# Altium schematic sheet IMU_Radio.SchDoc: Wacky Hat Schematic
size A3; DrawnBy: A. Finlayson, H. Pollard; Organization: Group 17; Address1: ECE Department; Address2: University of Canterbury; Address3: Christchurch 8041; Address4: New Zealand; Revision: 1; SheetNumber: 1; SheetTotal: 3
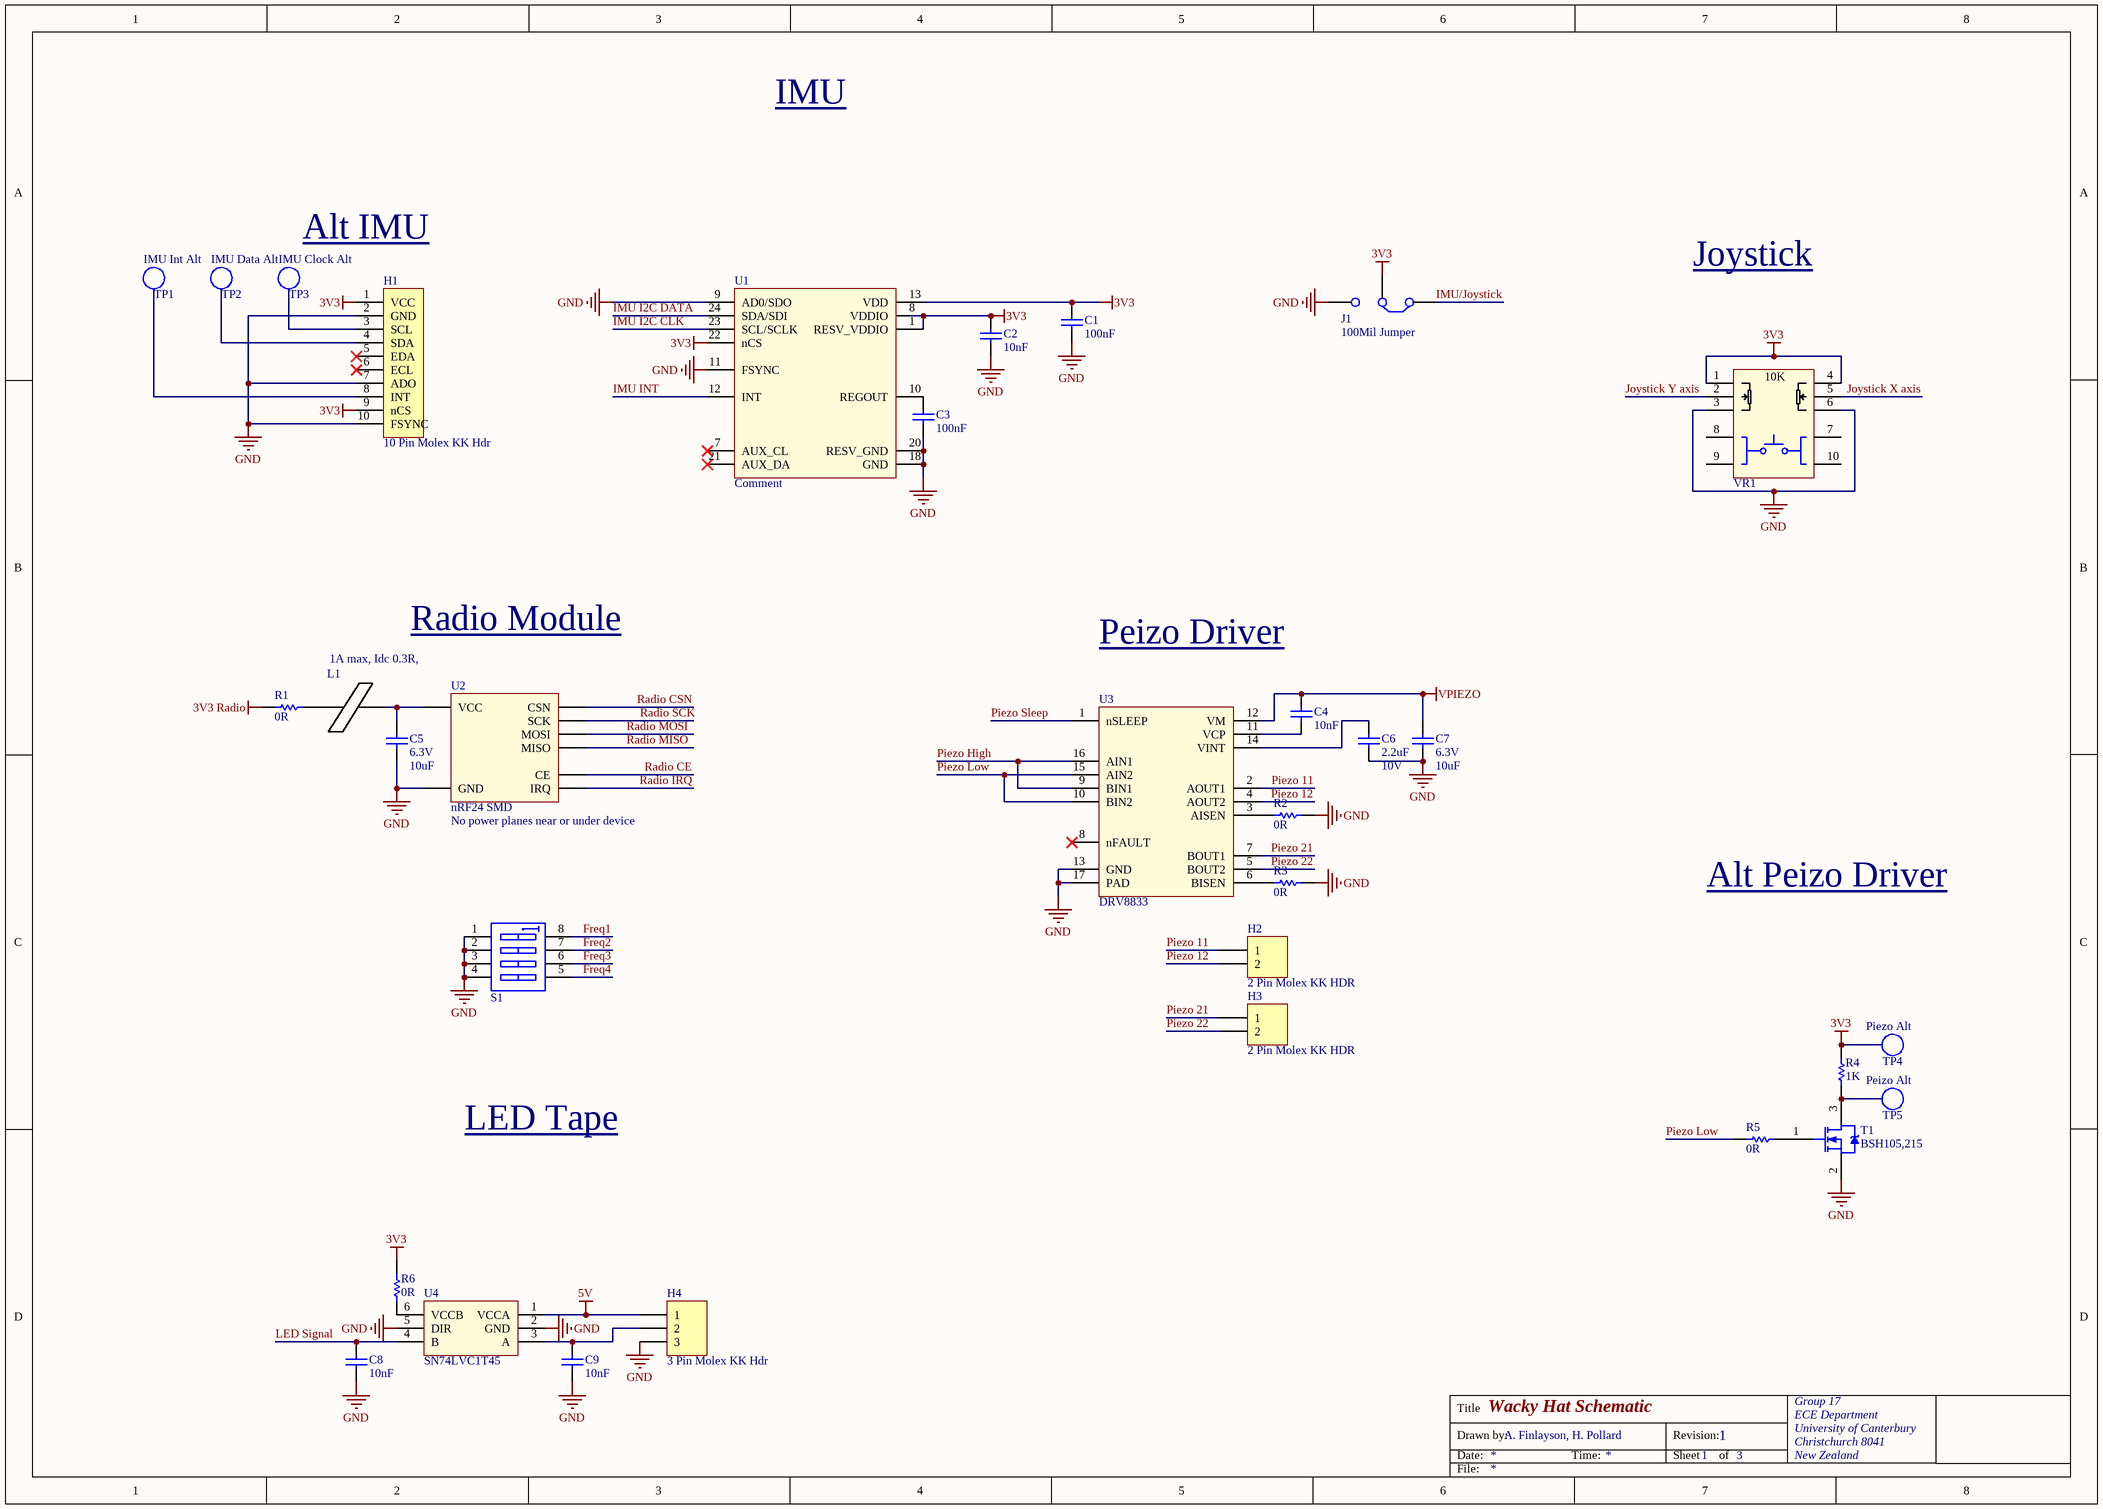
[diagram p0: IMU_Radio.SchDoc]

## Parts
C1  100nF  [CAPC1608L]
C2  10nF  [CAPC1608L]
C3  100nF  [CAPC1608L]
C4  10nF  [CAPC1608L]
C5  Voltage - Rated: 6.3V  [CAPC1608L]  (hidden comment: 10uF)
C6  Max Voltage: 10V  [CAPC1608L]  (hidden comment: 2.2uF)
C7  Voltage - Rated: 6.3V  [CAPC1608L]  (hidden comment: 10uF)
C8  10nF  [CAPC1608L]
C9  10nF  [CAPC1608L]
H1  10 Pin Molex KK Hdr  [MOLEX_KK_10_HDR]
H2  2 Pin Molex KK HDR  [MOLEX_KK_2_HDR]
H3  2 Pin Molex KK HDR  [MOLEX_KK_2_HDR]
H4  3 Pin Molex KK Hdr  [MOLEX_KK_3_HDR]
J1  100Mil Jumper  [JMP2.54-CO]
L1  1A max, Idc 0.3R,  [INDC3216L]
R1  0R  [RESC1608L]
R2  0R  [RESC1608L]
R3  0R  [RESC1608L]
R4  1K  [RESC1608L]
R5  0R  [RESC1608L]
R6  0R  [RESC1608L]
S1  WS_SW DIP-4  [DIP_SW_4WAY_SMD -]  (value not drawn)
T1  BSH105,215  [SOT23_L]
TP1  IMU Int Alt  [TP_0603]
TP2  IMU Data Alt  [TP_0603]
TP3  IMU Clock Alt  [TP_0603]
TP4  Piezo Alt  [TP_0603]
TP5  Peizo Alt  [TP_0603]
U1  Comment  [Quad24]
U2  nRF24 SMD  Warning: No power planes near or under device  [NRF24]
U3  DRV8833  [HTSOP16]
U4  SN74LVC1T45  [SOT23-6_N]
VR1  Joystick 10k with Sw  [Joystick_Sw]  (value not drawn)

## Nets
3V3: C1.2 C2.2 H1.1(VCC) H1.9(nCS) J1.2(C2) R4.2 R6.2 TP4.1(TP) U1.1(RESV_VDDIO) U1.8(VDDIO) U1.13(VDD) U1.22(nCS) VR1.1 VR1.4(1')
3V3 Radio: R1.1
5V: H4.1 U4.1(VCCA)
GND: C1.1 C2.1 C3.1 C5.1 C6.2 C7.1 C8.1 C9.1 H1.2(GND) H1.7(ADO) H1.10(FSYNC) H4.3 J1.3(C3) R2.2 R3.2 S1.1(A1) S1.2(A2) S1.3(A3) S1.4(A4) T1.2 U1.9(AD0/SDO) U1.11(FSYNC) U1.18(GND) U1.20(RESV_GND) U2.2(GND) U3.13(GND) U3.17(PAD) U4.2(GND) U4.5(DIR) VR1.3 VR1.6(3')
VPIEZO: C4.2 C7.2 U3.12(VM)
Freq1: S1.8(B1)
Freq2: S1.7(B2)
Freq3: S1.6(B3)
Freq4: S1.5(B4)
IMU I2C CLK: U1.23(SCL/SCLK)
IMU I2C DATA: U1.24(SDA/SDI)
IMU INT: U1.12(INT)
IMU/Joystick: J1.1(C1)
Joystick X axis: VR1.5(2')
Joystick Y axis: VR1.2
LED Signal: C8.2 U4.4(B)
Piezo 11: H2.1 U3.2(AOUT1)
Piezo 12: H2.2 U3.4(AOUT2)
Piezo 21: H3.1 U3.7(BOUT1)
Piezo 22: H3.2 U3.5(BOUT2)
Piezo High: U3.9(BIN1) U3.16(AIN1)
Piezo Low: R5.1 U3.10(BIN2) U3.15(AIN2)
Piezo Sleep: U3.1(nSLEEP)
Radio CE: U2.3(CE)
Radio CSN: U2.4(CSN)
Radio IRQ: U2.8(IRQ)
Radio MISO: U2.7(MISO)
Radio MOSI: U2.6(MOSI)
Radio SCK: U2.5(SCK)
NetC3_2: C3.2 U1.10(REGOUT)
NetC4_1: C4.1 U3.11(VCP)
NetC5_2: C5.2 L1.1 U2.1(VCC)
NetC6_1: C6.1 U3.14(VINT)
NetC9_2: C9.2 H4.2 U4.3(A)
NetH1_3: H1.3(SCL) TP3.1(TP)
NetH1_4: H1.4(SDA) TP2.1(TP)
NetH1_8: H1.8(INT) TP1.1(TP)
NetL1_2: L1.2 R1.2
NetR2_1: R2.1 U3.3(AISEN)
NetR3_1: R3.1 U3.6(BISEN)
NetR4_1: R4.1 T1.3 TP5.1(TP)
NetR5_2: R5.2 T1.1
NetR6_1: R6.1 U4.6(VCCB)

Not connected (* = marked no-connect by the designer): H1 5(EDA)* 6(ECL)*; U1 7(AUX_CL)* 21(AUX_DA)*; U3 8(nFAULT)*; VR1 7 8 9 10

## Notes on the sheet
- IMU
- Alt IMU
- Joystick
- Radio Module
- Peizo Driver
- Alt Peizo Driver
- LED Tape
- Title
- Drawn by:
- Date:
- Time:
- Revision:
- Sheet
- of
- File:
- (in symbol Joystick 10k with Sw) 10K

## Library data of the parts
C1 C3 = CC_100nF_0603: CAP CER 100nF X7R +-10% 50V 0603; PackageReference: 0603; Code_IPC: 1608 [0603]; Verify: *; Supplier: ECE Dept; Storage Location: PCB Assembly WS; Value: 100nF
C2 C4 C8 C9 = CC_10nF_0603: CAP CER 10nF X7R +-10% 50V 0603; PackageReference: 0603; Code_IPC: 1608 [0603]; Verify: *; Supplier: ECE Dept; Storage Location: PCB Assembly WS; Value: 10nF
C5 C7 = CC_10uF_0603: CAP CER 10UF X5R +-20% 6V3 0603; Supplier: ECE Dept; Storage Location: PCB Assembly WS; Value: 10uF
C6 = CC_2.2uF_0603: CAP CER 2.2uF X5R +-20% 10V 0603; PackageReference: 0603; Code_IPC: 1608 [0603]; Verify: *; Supplier: ECE Dept; Storage Location: PCB Assembly WS; Value: 2.2uF
H1 = JA_MOLEX_KK_10POS: CONN HEADER 10POS 2.54mm VERT_ Thru Hole; Supplier 1: Farnell; Supplier Part Number 1: 1756828; Supplier: ECE Dept; Storage Location: ECE Dept Store; Value: 10 Pin Molex KK Hdr
H2 H3 = JA_MOLEX_KK_2POS: CONN HEADER 2POS 2.54mm VERT_Thru Hole; Supplier 1: Farnell; Supplier Part Number 1: 1462926; Supplier: ECE Dept; Storage Location: ECE Dept Store; Value: 2 Pin Molex KK HDR
H4 = JA_MOLEX_KK_3POS: CONN HEADER 3POS 2.54mm VERT_Thru Hole; Manufacturer: Molex; Manufacturer PN: 22-23-2031; Supplier Part Number 1: 9731156; Supplier: ECE Dept; Supplier 1: Farnell; Storage Location: ECE Dept Store; Value: 3 Pin Molex KK Hdr
J1 = TP_JUMPER_CO: 2.54mm Jumper change over, Thru Hole; Supplier: ECE Dept; Storage Location: ECE$ Store
L1 = IN_Ferrite-Bead: Ferrite Bead, Rdc 0.3R, Z100MHZ 600R, Imax 1A, SMD 1206; Manufacturer: FAIR-RITE; Manufacturer PN: 2512066017Y1; DC Current Rating: 1; DC Resistance Max: 0.08; Ferrite Case Style: 1206 ^3216 Metric]; Frequency Range: 50MHz to 1; Impedance: 600; Impedance Tolerance: ± 25%; Supplier: ECE Dept; Storage Location: PCB Assembly WS; Ferrite Mounting: SMD; Supplier 1: Farnell; Supplier Part Number 1: 1612060; Manufacturer Part Number: 2512066017Y1; Value: 1A max, Idc 0.3R,
R1-R3 R5 R6 = RS_0R0: RES 0.0 OHM 1/10W 5% 0603 SMD; Storage Location: PCB Assembly WS; Supplier: ECE Dept; Value: 0R
R4 = RS_1K: RES 1.0K OHM 1/10W 5% 0603 SMD; Storage Location: PCB Assembly WS; Supplier: ECE Dept; Value: 1K
S1 = WS_SW DIP-4: DIP Switch, 4 Position, SPST SMD; Manufacturer: OMRON ELECTRONIC COMPONENTS; Manufacturer Part Number: A6SN-4101; Contact Current DC Max: 25; External Length / Height: 12.1; No. of Switch Positions: 4; Pitch Spacing: 2.54; Contact Configuration: SPST; Supplier 1: Farnell; Supplier Part Number 1: 2029425; Storage Location: PCB Assembly WS; Supplier: ECE Dept
T1 = TM_BSH105: MOSFET N-CH 20V 1.05A SOT-23; Manufacturer: NXP Semiconductors; FET Type: MOSFET N-Channel, Metal Oxide; Gate Charge (Qg) @ Vgs: 3.9nC @ 4.5V; Input Capacitance (Ciss) @ Vds: 152pF @ 16V; Power - Max: 417mW; Rds On (Max) @ Id, Vgs: 200 mOhm @ 600mA, 4.5V; Supplier 1: Farnell; Supplier 2: Digi-Key; Current - Continuous Drain (Id) @ 25° C: 1.05A; Drain to Source Voltage (Vdss): 20V; Package / Case: TO-236-3, SC-59, SOT-23-3; Pricing: 1=0.53, 10=0.42, 25=0.3544, 100=0.2885, 250=0.23896, 500=0.1974, 1000=0.14785 (NZD); Supplier Part Number 1: 1758066; Supplier Part Number 2: 568-6215-1-ND; Storage Location: PCB Assembly WS; Supplier: ECE Dept; Manufacturer Part Number: BSH105,215
TP1-TP5 = TP_0603: Test Point 1.65X0.9X1.2mm SMD; Manufacturer: TE Connectivity AMP Connectors; Manufacturer Part Number: 1625854-3; Supplier 1: Digi-Key; Mounting Type: Surface Mount; Terminal: 0.063" x 0.031" x 0.045" (1.60mm x 0.80mm x 1.15mm); Type: PC Test Point; Supplier Part Number 1: A106145CT-ND
U1 = MPU-9250: 9 axis IMU
U2 = NRF24: nRF24 SMD Module
U3 = DRV8833: Dual H-Bridge Motor Driver 1.5A
U4 = SN74LVC1T45: 1.8V - 5V level converter
VR1 = Joystick 10k with Sw: JOYSTICK 10K OHM 2 AXIS TH; Manufacturer 1: SparkFun; Manufacturer Part Number 1: COM-09032; Supplier 1: Digi-Key; Stock 1: 563; Pricing 1: 1=3.95000 (USD); RoHS: No; ComponentLink1URL: https://media.digikey.com/pdf/Data%20Sheets/Sparkfun%20PDFs/COM-09032_Web.pdf?src-supplier=Digi-Key; ComponentLink1Description: https://media.digikey.com/pdf/Data%20Sheets/Sparkfun%20PDFs/COM-09032_Web.pdf?src-supplier=Digi-Key; Supplier Part Number 1: 1568-1526-ND